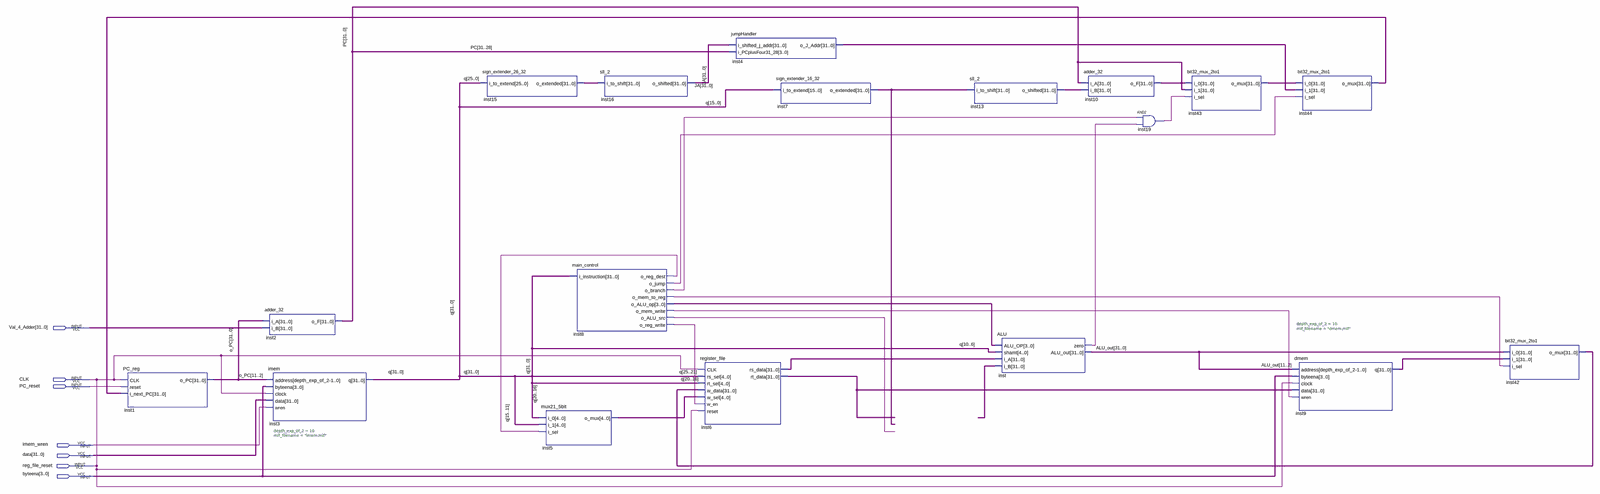
[diagram p0: schematic sheet, whole]
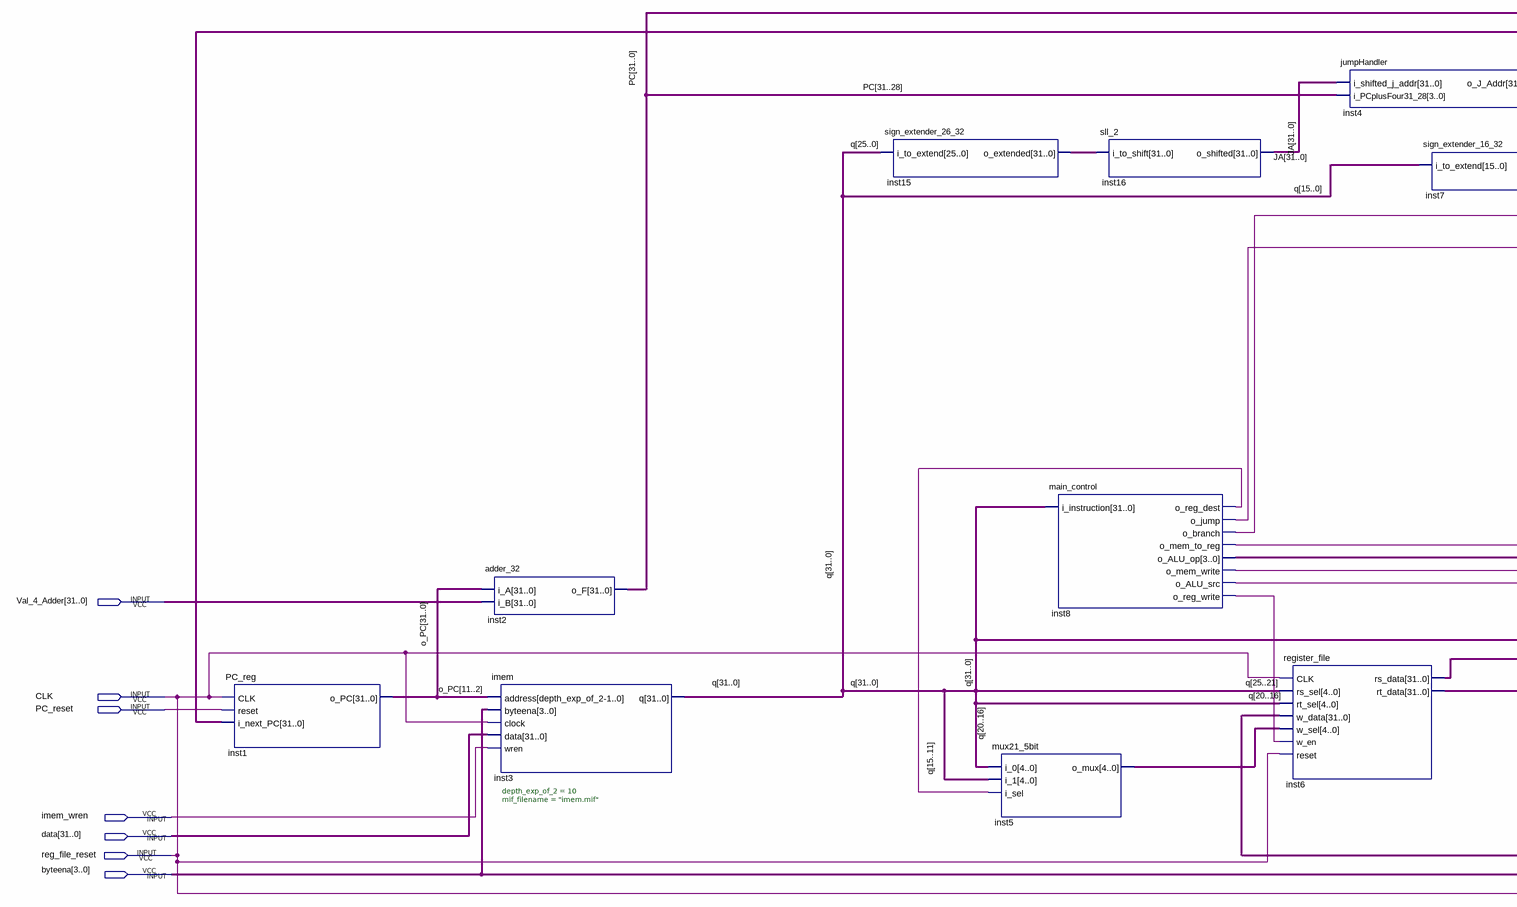
[diagram p1: schematic sheet, left part]
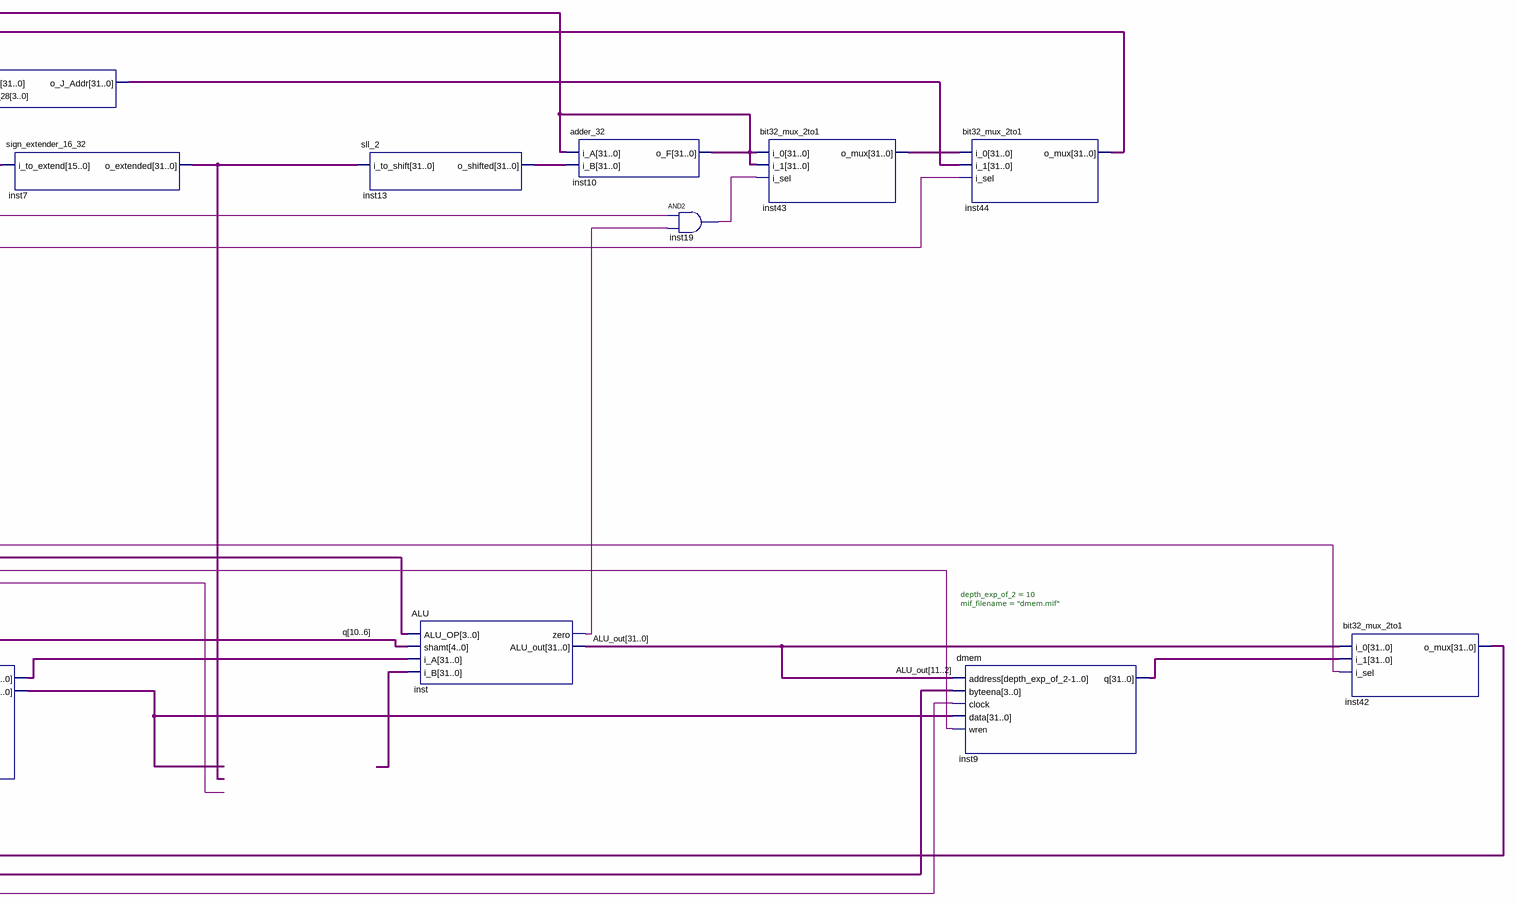
[diagram p2: schematic sheet, right part]
// Quartus schematic ProjectA.bdf as structural Verilog: 18 symbols, 7 pins
module ProjectA (
  input  [31:0] Val_4_Adder,
  input  CLK,
  input  PC_reset,
  input  imem_wren,
  input  [31:0] data,
  input  reg_file_reset,
  input  [3:0] byteena
);

  wire inst8_o_alu_src, inst8_o_branch, inst8_o_jump, inst8_o_mem_to_reg, inst8_o_mem_write,
       inst8_o_reg_dest, inst8_o_reg_write, inst19_out, inst_zero;
  wire [3:0] inst8_o_alu_op;
  wire [4:0] inst5_o_mux;
  wire [31:0] ALU_out, inst4_o_j_addr, inst6_rs_data, inst6_rt_data, inst7_o_extended, inst9_q,
       inst13_o_shifted, inst15_o_extended, inst42_o_mux, inst43_o_mux, inst44_o_mux, JA, o_PC, PC, q,
       undriven;

  PC_reg inst1 (.CLK(CLK), .reset(PC_reset), .i_next_PC(inst44_o_mux), .o_PC(o_PC));
  adder_32 inst2 (.i_A(o_PC), .i_B(Val_4_Adder), .o_F(PC));
  imem #(.depth_exp_of_2(10), .mif_filename("imem.mif")) inst3 (
    .address(o_PC[11:2]), .byteena(byteena), .clock(CLK), .data(data), .wren(imem_wren), .q(q));
  sign_extender_26_32 inst15 (.i_to_extend(q[25:0]), .o_extended(inst15_o_extended));
  mux21_5bit inst5 (.i_0(q[20:16]), .i_1(q[15:11]), .i_sel(inst8_o_reg_dest), .o_mux(inst5_o_mux));
  main_control inst8 (
    .i_instruction(q), .o_reg_dest(inst8_o_reg_dest), .o_jump(inst8_o_jump), .o_branch(inst8_o_branch),
    .o_mem_to_reg(inst8_o_mem_to_reg), .o_ALU_op(inst8_o_alu_op), .o_mem_write(inst8_o_mem_write),
    .o_ALU_src(inst8_o_alu_src), .o_reg_write(inst8_o_reg_write));
  sll_2 inst16 (.i_to_shift(inst15_o_extended), .o_shifted(JA));
  register_file inst6 (
    .CLK(CLK), .rs_sel(q[25:21]), .rt_sel(q[20:16]), .w_data(inst42_o_mux), .w_sel(inst5_o_mux),
    .w_en(inst8_o_reg_write), .reset(CLK), .rs_data(inst6_rs_data), .rt_data(inst6_rt_data));
  jumpHandler inst4 (.i_shifted_j_addr(JA), .i_PCplusFour31_28(PC[31:28]), .o_J_Addr(inst4_o_j_addr));
  sign_extender_16_32 inst7 (.i_to_extend(q[15:0]), .o_extended(inst7_o_extended));
  sll_2 inst13 (.i_to_shift(inst7_o_extended), .o_shifted(inst13_o_shifted));
  ALU inst (
    .ALU_OP(inst8_o_alu_op), .shamt(q[10:6]), .i_A(inst6_rs_data), .i_B(undriven), .zero(inst_zero),
    .ALU_out(ALU_out));
  adder_32 inst10 (.i_A(PC), .i_B(inst13_o_shifted), .o_F(PC));
  and inst19 (inst19_out, inst8_o_branch, inst_zero);
  bit32_mux_2to1 inst43 (.i_0(PC), .i_1(PC), .i_sel(inst19_out), .o_mux(inst43_o_mux));
  bit32_mux_2to1 inst44 (.i_0(inst43_o_mux), .i_1(inst4_o_j_addr), .i_sel(inst8_o_jump), .o_mux(inst44_o_mux));
  dmem #(.depth_exp_of_2(10), .mif_filename("dmem.mif")) inst9 (
    .address(ALU_out[11:2]), .byteena(byteena), .clock(CLK), .data(inst6_rt_data), .wren(inst8_o_mem_write),
    .q(inst9_q));
  bit32_mux_2to1 inst42 (.i_0(ALU_out), .i_1(inst9_q), .i_sel(inst8_o_mem_to_reg), .o_mux(inst42_o_mux));

  assign reg_file_reset = CLK;
endmodule
